# Altium schematic sheet ZYNQ_POWER.SchDoc
size A4; SheetNumber: 7; SheetTotal: 13
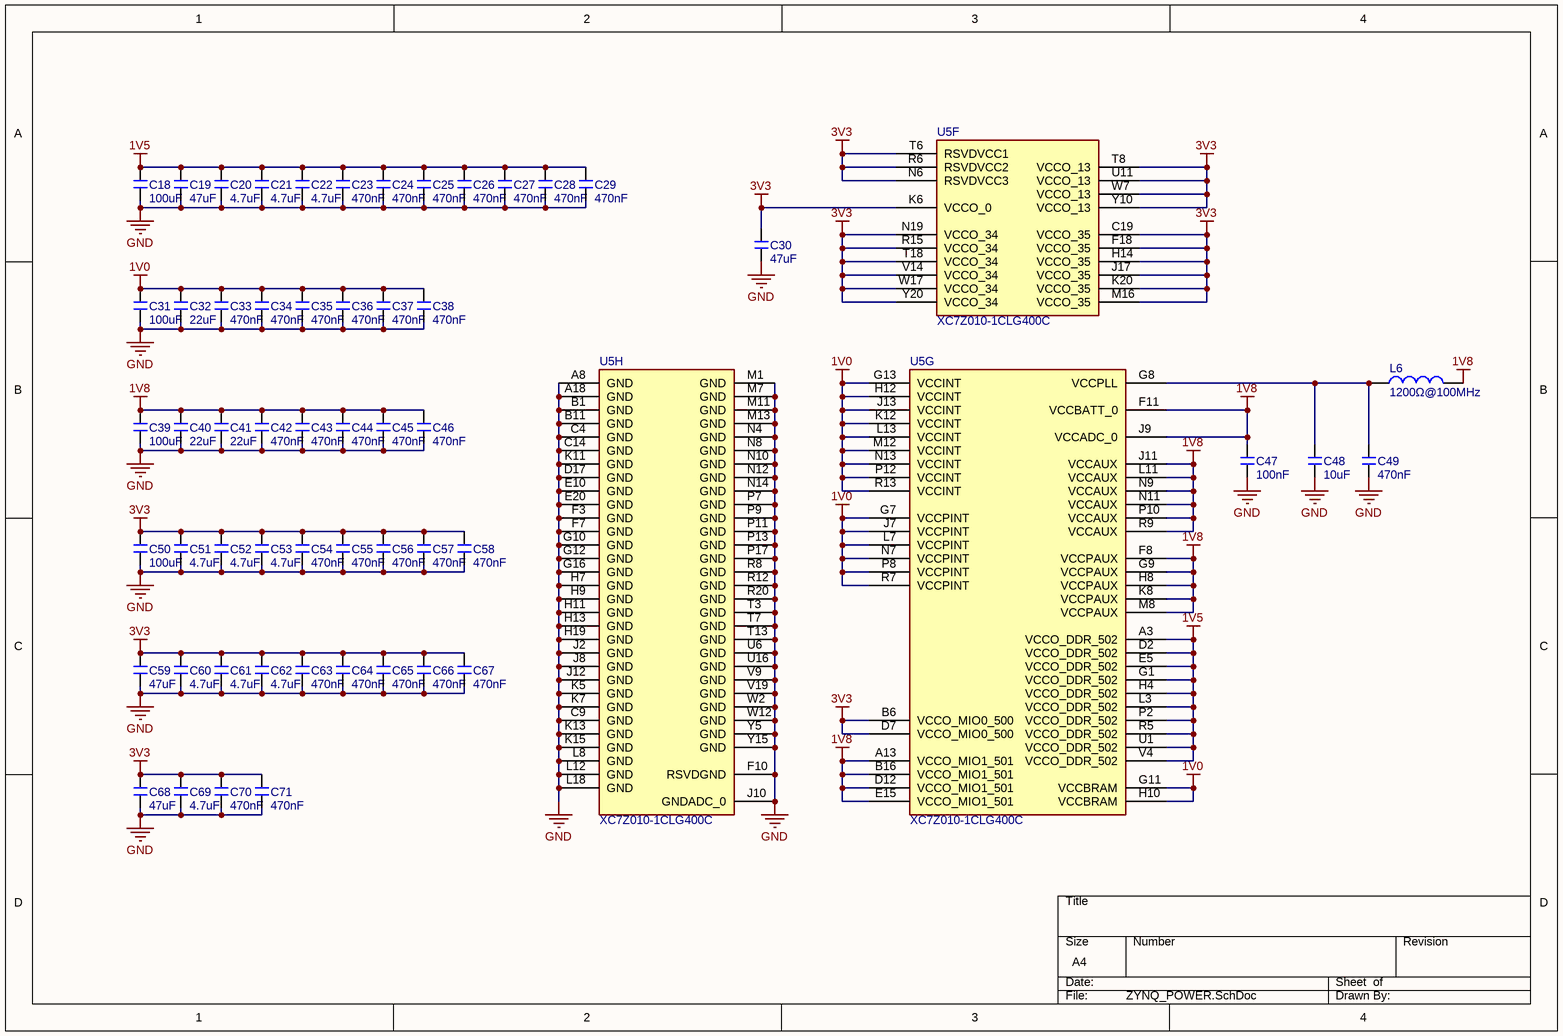
[diagram p0: ZYNQ_POWER.SchDoc]

## Parts
C18  100uF  [C 0805_L]
C19  47uF  [C 0805_L]
C20  4.7uF  [C 0603_L]
C21  4.7uF  [C 0603_L]
C22  4.7uF  [C 0603_L]
C23  470nF  [C 0805_L]
C24  470nF  [C 0805_L]
C25  470nF  [C 0805_L]
C26  470nF  [C 0805_L]
C27  470nF  [C 0805_L]
C28  470nF  [C 0805_L]
C29  470nF  [C 0805_L]
C30  47uF  [C 0805_L]
C31  100uF  [C 0805_L]
C32  22uF  [C 0805_L]
C33  470nF  [C 0805_L]
C34  470nF  [C 0805_L]
C35  470nF  [C 0805_L]
C36  470nF  [C 0805_L]
C37  470nF  [C 0805_L]
C38  470nF  [C 0805_L]
C39  100uF  [C 0805_L]
C40  22uF  [C 0805_L]
C41  22uF  [C 0805_L]
C42  470nF  [C 0805_L]
C43  470nF  [C 0805_L]
C44  470nF  [C 0805_L]
C45  470nF  [C 0805_L]
C46  470nF  [C 0805_L]
C47  100nF  [C 0402_L]
C48  10uF  [C 0603_L]
C49  470nF  [C 0805_L]
C50  100uF  [C 0805_L]
C51  4.7uF  [C 0603_L]
C52  4.7uF  [C 0603_L]
C53  4.7uF  [C 0603_L]
C54  470nF  [C 0805_L]
C55  470nF  [C 0805_L]
C56  470nF  [C 0805_L]
C57  470nF  [C 0805_L]
C58  470nF  [C 0805_L]
C59  47uF  [C 0805_L]
C60  4.7uF  [C 0603_L]
C61  4.7uF  [C 0603_L]
C62  4.7uF  [C 0603_L]
C63  470nF  [C 0805_L]
C64  470nF  [C 0805_L]
C65  470nF  [C 0805_L]
C66  470nF  [C 0805_L]
C67  470nF  [C 0805_L]
C68  47uF  [C 0805_L]
C69  4.7uF  [C 0603_L]
C70  470nF  [C 0805_L]
C71  470nF  [C 0805_L]
L6  1200Ω@100MHz  [L 0805]
U5  XC7Z010-1CLG400C  [CLG400]  (parts F,G,H of 9)

## Nets
1V0: C31.1 C32.2 C33.2 C34.2 C35.2 C36.2 C37.2 C38.2 U5.G7(VCCPINT) U5.G11(VCCBRAM) U5.G13(VCCINT) U5.H10(VCCBRAM) U5.H12(VCCINT) U5.J7(VCCPINT) U5.J13(VCCINT) U5.K12(VCCINT) U5.L7(VCCPINT) U5.L13(VCCINT) U5.M12(VCCINT) U5.N7(VCCPINT) U5.N13(VCCINT) U5.P8(VCCPINT) U5.P12(VCCINT) U5.R7(VCCPINT) U5.R13(VCCINT)
1V5: C18.1 C19.2 C20.2 C21.2 C22.2 C23.2 C24.2 C25.2 C26.2 C27.2 C28.2 C29.2 U5.A3(VCCO_DDR_502) U5.D2(VCCO_DDR_502) U5.E5(VCCO_DDR_502) U5.G1(VCCO_DDR_502) U5.H4(VCCO_DDR_502) U5.L3(VCCO_DDR_502) U5.P2(VCCO_DDR_502) U5.R5(VCCO_DDR_502) U5.U1(VCCO_DDR_502) U5.V4(VCCO_DDR_502)
1V8: C39.1 C40.2 C41.2 C42.2 C43.2 C44.2 C45.2 C46.2 C47.2 L6.2 U5.A13(VCCO_MIO1_501) U5.B16(VCCO_MIO1_501) U5.D12(VCCO_MIO1_501) U5.E15(VCCO_MIO1_501) U5.F8(VCCPAUX) U5.F11(VCCBATT_0) U5.G9(VCCPAUX) U5.H8(VCCPAUX) U5.J9(VCCADC_0) U5.J11(VCCAUX) U5.K8(VCCPAUX) U5.L11(VCCAUX) U5.M8(VCCPAUX) U5.N9(VCCAUX) U5.N11(VCCAUX) U5.P10(VCCAUX) U5.R9(VCCAUX)
3V3: C30.2 C50.1 C51.2 C52.2 C53.2 C54.2 C55.2 C56.2 C57.2 C58.2 C59.1 C60.2 C61.2 C62.2 C63.2 C64.2 C65.2 C66.2 C67.2 C68.1 C69.2 C70.2 C71.2 U5.B6(VCCO_MIO0_500) U5.C19(VCCO_35) U5.D7(VCCO_MIO0_500) U5.F18(VCCO_35) U5.H14(VCCO_35) U5.J17(VCCO_35) U5.K6(VCCO_0) U5.K20(VCCO_35) U5.M16(VCCO_35) U5.N6(RSVDVCC3) U5.N19(VCCO_34) U5.R6(RSVDVCC2) U5.R15(VCCO_34) U5.T6(RSVDVCC1) U5.T8(VCCO_13) U5.T18(VCCO_34) U5.U11(VCCO_13) U5.V14(VCCO_34) U5.W7(VCCO_13) U5.W17(VCCO_34) U5.Y10(VCCO_13) U5.Y20(VCCO_34)
GND: C18.2 C19.1 C20.1 C21.1 C22.1 C23.1 C24.1 C25.1 C26.1 C27.1 C28.1 C29.1 C30.1 C31.2 C32.1 C33.1 C34.1 C35.1 C36.1 C37.1 C38.1 C39.2 C40.1 C41.1 C42.1 C43.1 C44.1 C45.1 C46.1 C47.1 C48.1 C49.1 C50.2 C51.1 C52.1 C53.1 C54.1 C55.1 C56.1 C57.1 C58.1 C59.2 C60.1 C61.1 C62.1 C63.1 C64.1 C65.1 C66.1 C67.1 C68.2 C69.1 C70.1 C71.1 U5.A8(GND) U5.A18(GND) U5.B1(GND) U5.B11(GND) U5.C4(GND) U5.C9(GND) U5.C14(GND) U5.D17(GND) U5.E10(GND) U5.E20(GND) U5.F3(GND) U5.F7(GND) U5.F10(RSVDGND) U5.G10(GND) U5.G12(GND) U5.G16(GND) U5.H7(GND) U5.H9(GND) U5.H11(GND) U5.H13(GND) U5.H19(GND) U5.J2(GND) U5.J8(GND) U5.J10(GNDADC_0) U5.J12(GND) U5.K5(GND) U5.K7(GND) U5.K11(GND) U5.K13(GND) U5.K15(GND) U5.L8(GND) U5.L12(GND) U5.L18(GND) U5.M1(GND) U5.M7(GND) U5.M11(GND) U5.M13(GND) U5.N4(GND) U5.N8(GND) U5.N10(GND) U5.N12(GND) U5.N14(GND) U5.P7(GND) U5.P9(GND) U5.P11(GND) U5.P13(GND) U5.P17(GND) U5.R8(GND) U5.R12(GND) U5.R20(GND) U5.T3(GND) U5.T7(GND) U5.T13(GND) U5.U6(GND) U5.U16(GND) U5.V9(GND) U5.V19(GND) U5.W2(GND) U5.W12(GND) U5.Y5(GND) U5.Y15(GND)
NetC48_2: C48.2 C49.2 L6.1 U5.G8(VCCPLL)

## Library data of the parts
C18-C71 = C: 无极性贴片电容; 版权归属: 源创客; BOM名称: 无极性贴片电容; 学习资源: www.ooocke.com
L6 = L: 小功率贴片电感; 版权归属: 源创客; BOM名称: 小功率贴片电感; 学习资源: www.ooocke.com
U5 = XC7Z010-1CLG400C: ZYNQ7000芯片